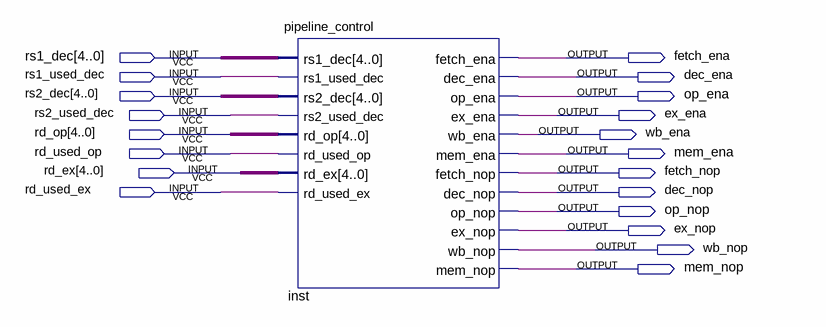
[diagram p0: schematic sheet]
// Quartus schematic pipeline_testbench.bdf as structural Verilog: 1 symbols, 20 pins
module pipeline_testbench (
  input  [4:0] rs1_dec,
  input  rs1_used_dec,
  input  [4:0] rs2_dec,
  input  rs2_used_dec,
  input  [4:0] rd_op,
  input  rd_used_op,
  input  [4:0] rd_ex,
  input  rd_used_ex,
  output fetch_ena,
  output dec_ena,
  output op_ena,
  output ex_ena,
  output wb_ena,
  output mem_ena,
  output fetch_nop,
  output dec_nop,
  output op_nop,
  output ex_nop,
  output wb_nop,
  output mem_nop
);

  pipeline_control inst (
    .rs1_dec(rs1_dec), .rs1_used_dec(rs1_used_dec), .rs2_dec(rs2_dec), .rs2_used_dec(rs2_used_dec),
    .rd_op(rd_op), .rd_used_op(rd_used_op), .rd_ex(rd_ex), .rd_used_ex(rd_used_ex), .fetch_ena(fetch_ena),
    .dec_ena(dec_ena), .op_ena(op_ena), .ex_ena(ex_ena), .wb_ena(wb_ena), .mem_ena(mem_ena),
    .fetch_nop(fetch_nop), .dec_nop(dec_nop), .op_nop(op_nop), .ex_nop(ex_nop), .wb_nop(wb_nop),
    .mem_nop(mem_nop));
endmodule
